# Altium schematic sheet Gate-Driver.SchDoc
size A4
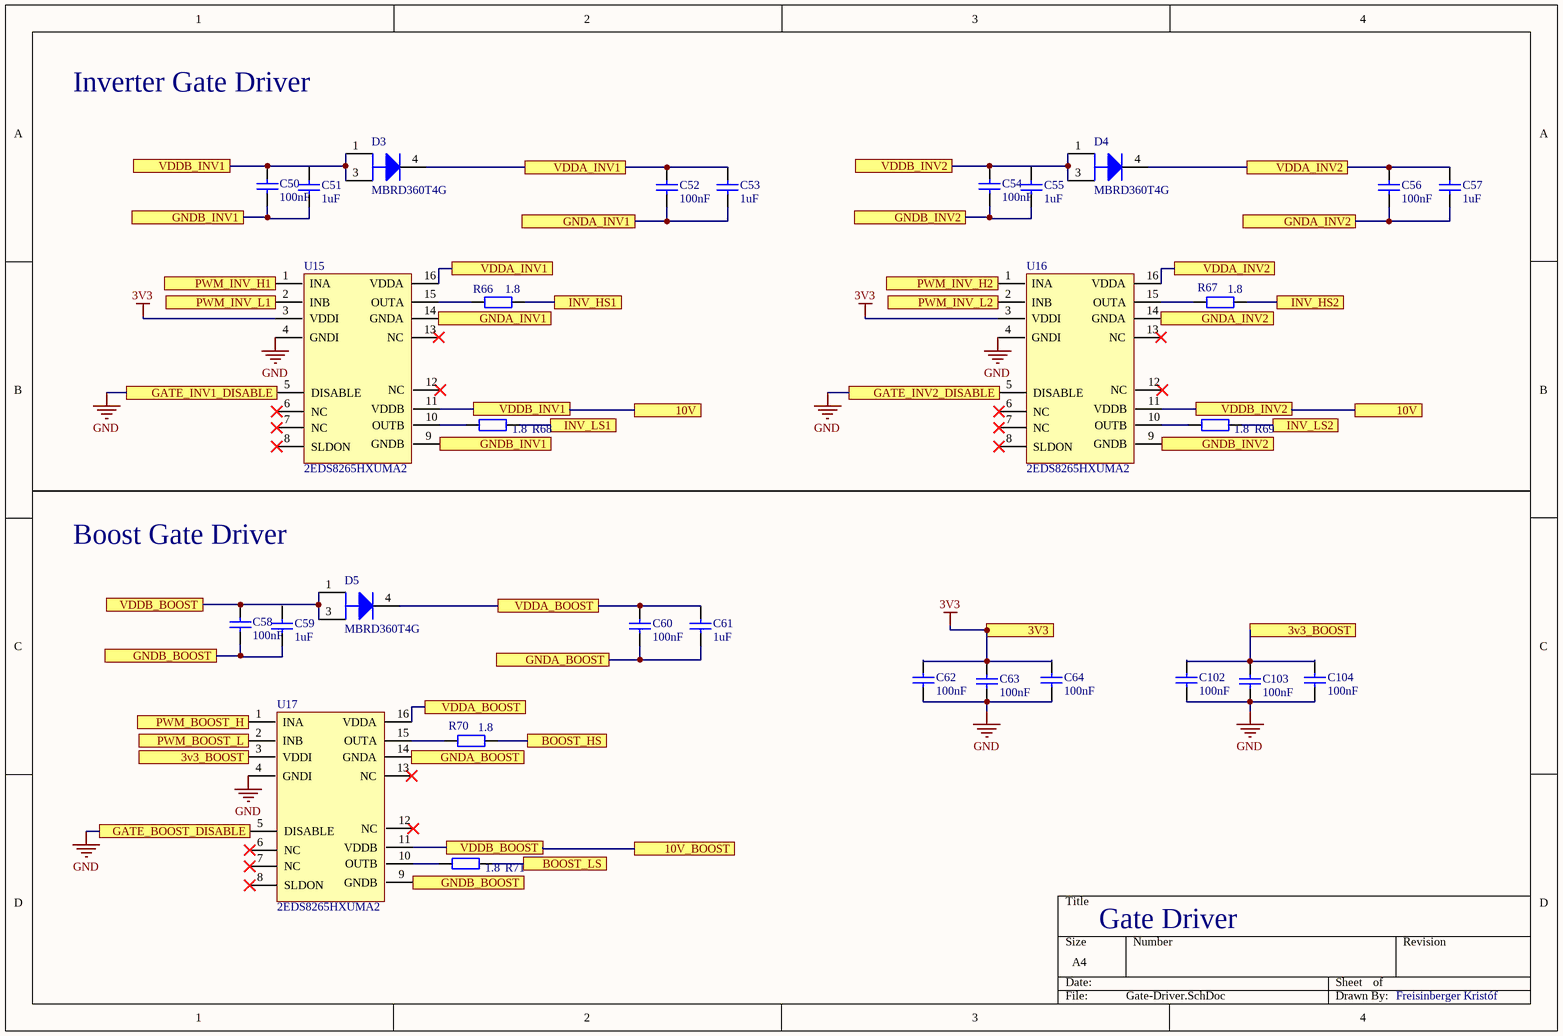
[diagram p0: Gate-Driver.SchDoc]

## Parts
C50  100nF  [FP_0805_CAP_085]
C51  1uF  [FP_0805_CAP_085]
C52  100nF  [FP_0805_CAP_085]
C53  1uF  [FP_0805_CAP_085]
C54  100nF  [FP_0805_CAP_085]
C55  1uF  [FP_0805_CAP_085]
C56  100nF  [FP_0805_CAP_085]
C57  1uF  [FP_0805_CAP_085]
C58  100nF  [FP_0805_CAP_085]
C59  1uF  [FP_0805_CAP_085]
C60  100nF  [FP_0805_CAP_085]
C61  1uF  [FP_0805_CAP_085]
C62  100nF  [FP_0805_CAP_085]
C63  100nF  [FP_0805_CAP_085]
C64  100nF  [FP_0805_CAP_085]
C102  100nF  [FP_0805_CAP_085]
C103  100nF  [FP_0805_CAP_085]
C104  100nF  [FP_0805_CAP_085]
D3  MBRD360T4G  [ONSC-DPAK-3-369C-01_V]
D4  MBRD360T4G  [ONSC-DPAK-3-369C-01_V]
D5  MBRD360T4G  [ONSC-DPAK-3-369C-01_V]
R66  1.8  [FP_0805_RES]
R67  1.8  [FP_0805_RES]
R68  1.8  [FP_0805_RES]
R69  1.8  [FP_0805_RES]
R70  1.8  [FP_0805_RES]
R71  1.8  [FP_0805_RES]
U15  2EDS8265HXUMA2  [EXAR-WSOIC-16_N]
U16  2EDS8265HXUMA2  [EXAR-WSOIC-16_N]
U17  2EDS8265HXUMA2  [EXAR-WSOIC-16_N]

## Ports
3V3, 3v3_BOOST, 10V, 10V_BOOST, BOOST_HS, BOOST_LS, GATE_BOOST_DISABLE, GATE_INV1_DISABLE, GATE_INV2_DISABLE, GNDA_BOOST, GNDA_INV1, GNDA_INV2, GNDB_BOOST, GNDB_INV1, GNDB_INV2, INV_HS1, INV_HS2, INV_LS1, INV_LS2, PWM_BOOST_H, PWM_BOOST_L, PWM_INV_H1, PWM_INV_H2, PWM_INV_L1, PWM_INV_L2, VDDA_BOOST, VDDA_INV1, VDDA_INV2, VDDB_BOOST, VDDB_INV1, VDDB_INV2

## Nets
3V3: C62.2 C63.2 C64.2 U15.3(VDDI) U16.3(VDDI) ; port 3V3
GND: C62.1 C63.1 C64.1 C102.1 C103.1 C104.1 U15.4(GNDI) U15.5(DISABLE) U16.4(GNDI) U16.5(DISABLE) U17.4(GNDI) U17.5(DISABLE) ; port GATE_BOOST_DISABLE, port GATE_INV1_DISABLE, port GATE_INV2_DISABLE
3v3_BOOST: C102.2 C103.2 C104.2 U17.3(VDDI) ; port 3v3_BOOST
10V: C50.2 C54.2 D3.1(A) D3.3(A) D4.1(A) D4.3(A) U15.11(VDDB) U16.11(VDDB) ; port VDDB_INV1, port VDDB_INV2, port 10V
10V_BOOST: C58.2 D5.1(A) D5.3(A) U17.11(VDDB) ; port VDDB_BOOST, port 10V_BOOST
BOOST_HS: R70.2 ; port BOOST_HS
BOOST_LS: R71.2 ; port BOOST_LS
GNDA_BOOST: C60.1 C61.1 U17.14(GNDA) ; port GNDA_BOOST
GNDA_INV1: C52.1 C53.1 U15.14(GNDA) ; port GNDA_INV1
GNDA_INV2: C56.1 C57.1 U16.14(GNDA) ; port GNDA_INV2
GNDB_BOOST: C58.1 C59.1 U17.9(GNDB) ; port GNDB_BOOST
GNDB_INV1: C50.1 C51.1 U15.9(GNDB) ; port GNDB_INV1
GNDB_INV2: C54.1 C55.1 U16.9(GNDB) ; port GNDB_INV2
INV_HS1: R66.2 ; port INV_HS1
INV_HS2: R67.2 ; port INV_HS2
INV_LS1: R68.2 ; port INV_LS1
INV_LS2: R69.2 ; port INV_LS2
PWM_BOOST_H: U17.1(INA) ; port PWM_BOOST_H
PWM_BOOST_L: U17.2(INB) ; port PWM_BOOST_L
PWM_INV_H1: U15.1(INA) ; port PWM_INV_H1
PWM_INV_H2: U16.1(INA) ; port PWM_INV_H2
PWM_INV_L1: U15.2(INB) ; port PWM_INV_L1
PWM_INV_L2: U16.2(INB) ; port PWM_INV_L2
VDDA_BOOST: C60.2 C61.2 D5.4(K) U17.16(VDDA) ; port VDDA_BOOST
VDDA_INV1: C52.2 C53.2 D3.4(K) U15.16(VDDA) ; port VDDA_INV1
VDDA_INV2: C56.2 C57.2 D4.4(K) U16.16(VDDA) ; port VDDA_INV2
NetR66_1: R66.1 U15.15(OUTA)
NetR67_1: R67.1 U16.15(OUTA)
NetR68_1: R68.1 U15.10(OUTB)
NetR69_1: R69.1 U16.10(OUTB)
NetR70_1: R70.1 U17.15(OUTA)
NetR71_1: R71.1 U17.10(OUTB)

Not connected (* = marked no-connect by the designer): C51 2; C55 2; C59 2; U15 6(NC)* 7(NC)* 8(SLDON)* 12(NC)* 13(NC)*; U16 6(NC)* 7(NC)* 8(SLDON)* 12(NC)* 13(NC)*; U17 6(NC)* 7(NC)* 8(SLDON)* 12(NC)* 13(NC)*

## Notes on the sheet
- Inverter Gate Driver
- Boost Gate Driver
- Gate Driver
- Freisinberger Kristóf

## Library data of the parts
C50-C64 C102-C104 = CAP: Capacitor
  C50 C52 C54 C56 C58 C60 C62-C64 C102-C104: Value: 100nF
  C51 C53 C55 C57 C59 C61: Value: 1uF
D3-D5 = CMP-1055-00192-1: SWITCHMODE(TM) Power Rectifier, 3-Pin DPAK, Pb-Free, Tape and Reel; Manufacturer: On Semiconductor; Configuration: Single; IFSM Max (A): 75; Mounting Technology: Surface Mount; ComponentLink2Description: Datasheet; ComponentLink3URL: http://www.onsemi.cn/pub_link/Collateral/369C.PDF; DatasheetVersion: Rev. 8; ComponentLink2URL: http://www.onsemi.com/pub_link/Collateral/MBRD320-D.PDF; PackageDescription: 3-Pin Flange Mount, Body 6.54 x 6.095 mm, Pitch 2.29 mm; ComponentLink1URL: http://www.onsemi.com/; Packing: Tape and Reel; RoHS: TRUE; ComponentLink1Description: Manufacturer URL; ComponentLink3Description: Package Specification; PackageVersion: Rev. E, 02/2014; PackageReference: DPAK-3-369C-01; PartNumber: MBRD360T4G
R66-R71 = RES: Resistor; Value: 1.8
U15-U17 = GATE_DRIVER_2EDS8265HXUMA2: 2EDS8265HXUMA2 / Gate-Driver 8A; Manufacturer: Exar; Max Supply Voltage: 5.5V; Min Supply Voltage: 3V; Nominal Supply Current: 1mA; Number of Transmitters: 2; Logic Function: Transceiver; Number of Transceivers: 1; Propagation Delay: 0.15us; Number of I/Os: 4; Max Power Dissipation: 1.26W; Supplier 1: Allied Electronics; Manufacturer Part Number: 2EDS8265HXUMA2; RoHS: Yes; Category: RS-232 / RS-422 / RS-485 Interface ICs; Case/Package: SOIC W; Number of Pins: 16; Min Operating Temperature: 0°C; Max Operating Temperature: 70°C; Package Quantity: 41; Packaging: Rail/Tube; Series: -; Supply Current: 1mA; Number of Receivers: 2; Length: 10.3mm; Width: 7.5mm; Height: 2.55mm; Radiation Hardening: No; Lead Free: Lead Free; ComponentLink1URL: https://datasheet.ciiva.com/22828/0900766b81141d49-22828237.pdf?src-supplier=RSComponents; ComponentLink1Description: https://datasheet.ciiva.com/22828/0900766b81141d49-22828237.pdf?src-supplier=RSComponents; ComponentLink2URL: https://datasheet.ciiva.com/1715/sp3222eb-sp3232eb-103-081414-1715199.pdf?src-supplier=Digi-Key; ComponentLink2Description: https://datasheet.ciiva.com/1715/sp3222eb-sp3232eb-103-081414-1715199.pdf?src-supplier=Digi-Key; ComponentLink3URL: https://datasheet.ciiva.com/16380/sp3232ebca-l-16380121.pdf?src-supplier=Future+Electronics; ComponentLink3Description: https://datasheet.ciiva.com/16380/sp3232ebca-l-16380121.pdf?src-supplier=Future+Electronics; ComponentLink4URL: https://datasheet.ciiva.com/15208/getdatasheetpartid-558353-15208838.pdf?src-supplier=Verical; ComponentLink4Description: https://datasheet.ciiva.com/15208/getdatasheetpartid-558353-15208838.pdf?src-supplier=Verical; Number of Drivers: 2